# EasyEDA Pro project ProPrj_gd32f103c8t6扩展板_2026-03-23.epro

# Schematic Schematic1
Board Name: Board1; Create Date: 2026-03-16; Page Name: P1; Project Name: gd32f103c8t6扩展板; Schematic Name: Schematic1; Update Date: 2026-03-16; Company: 嘉立创EDA; Page Size: A4; Version: V1.0
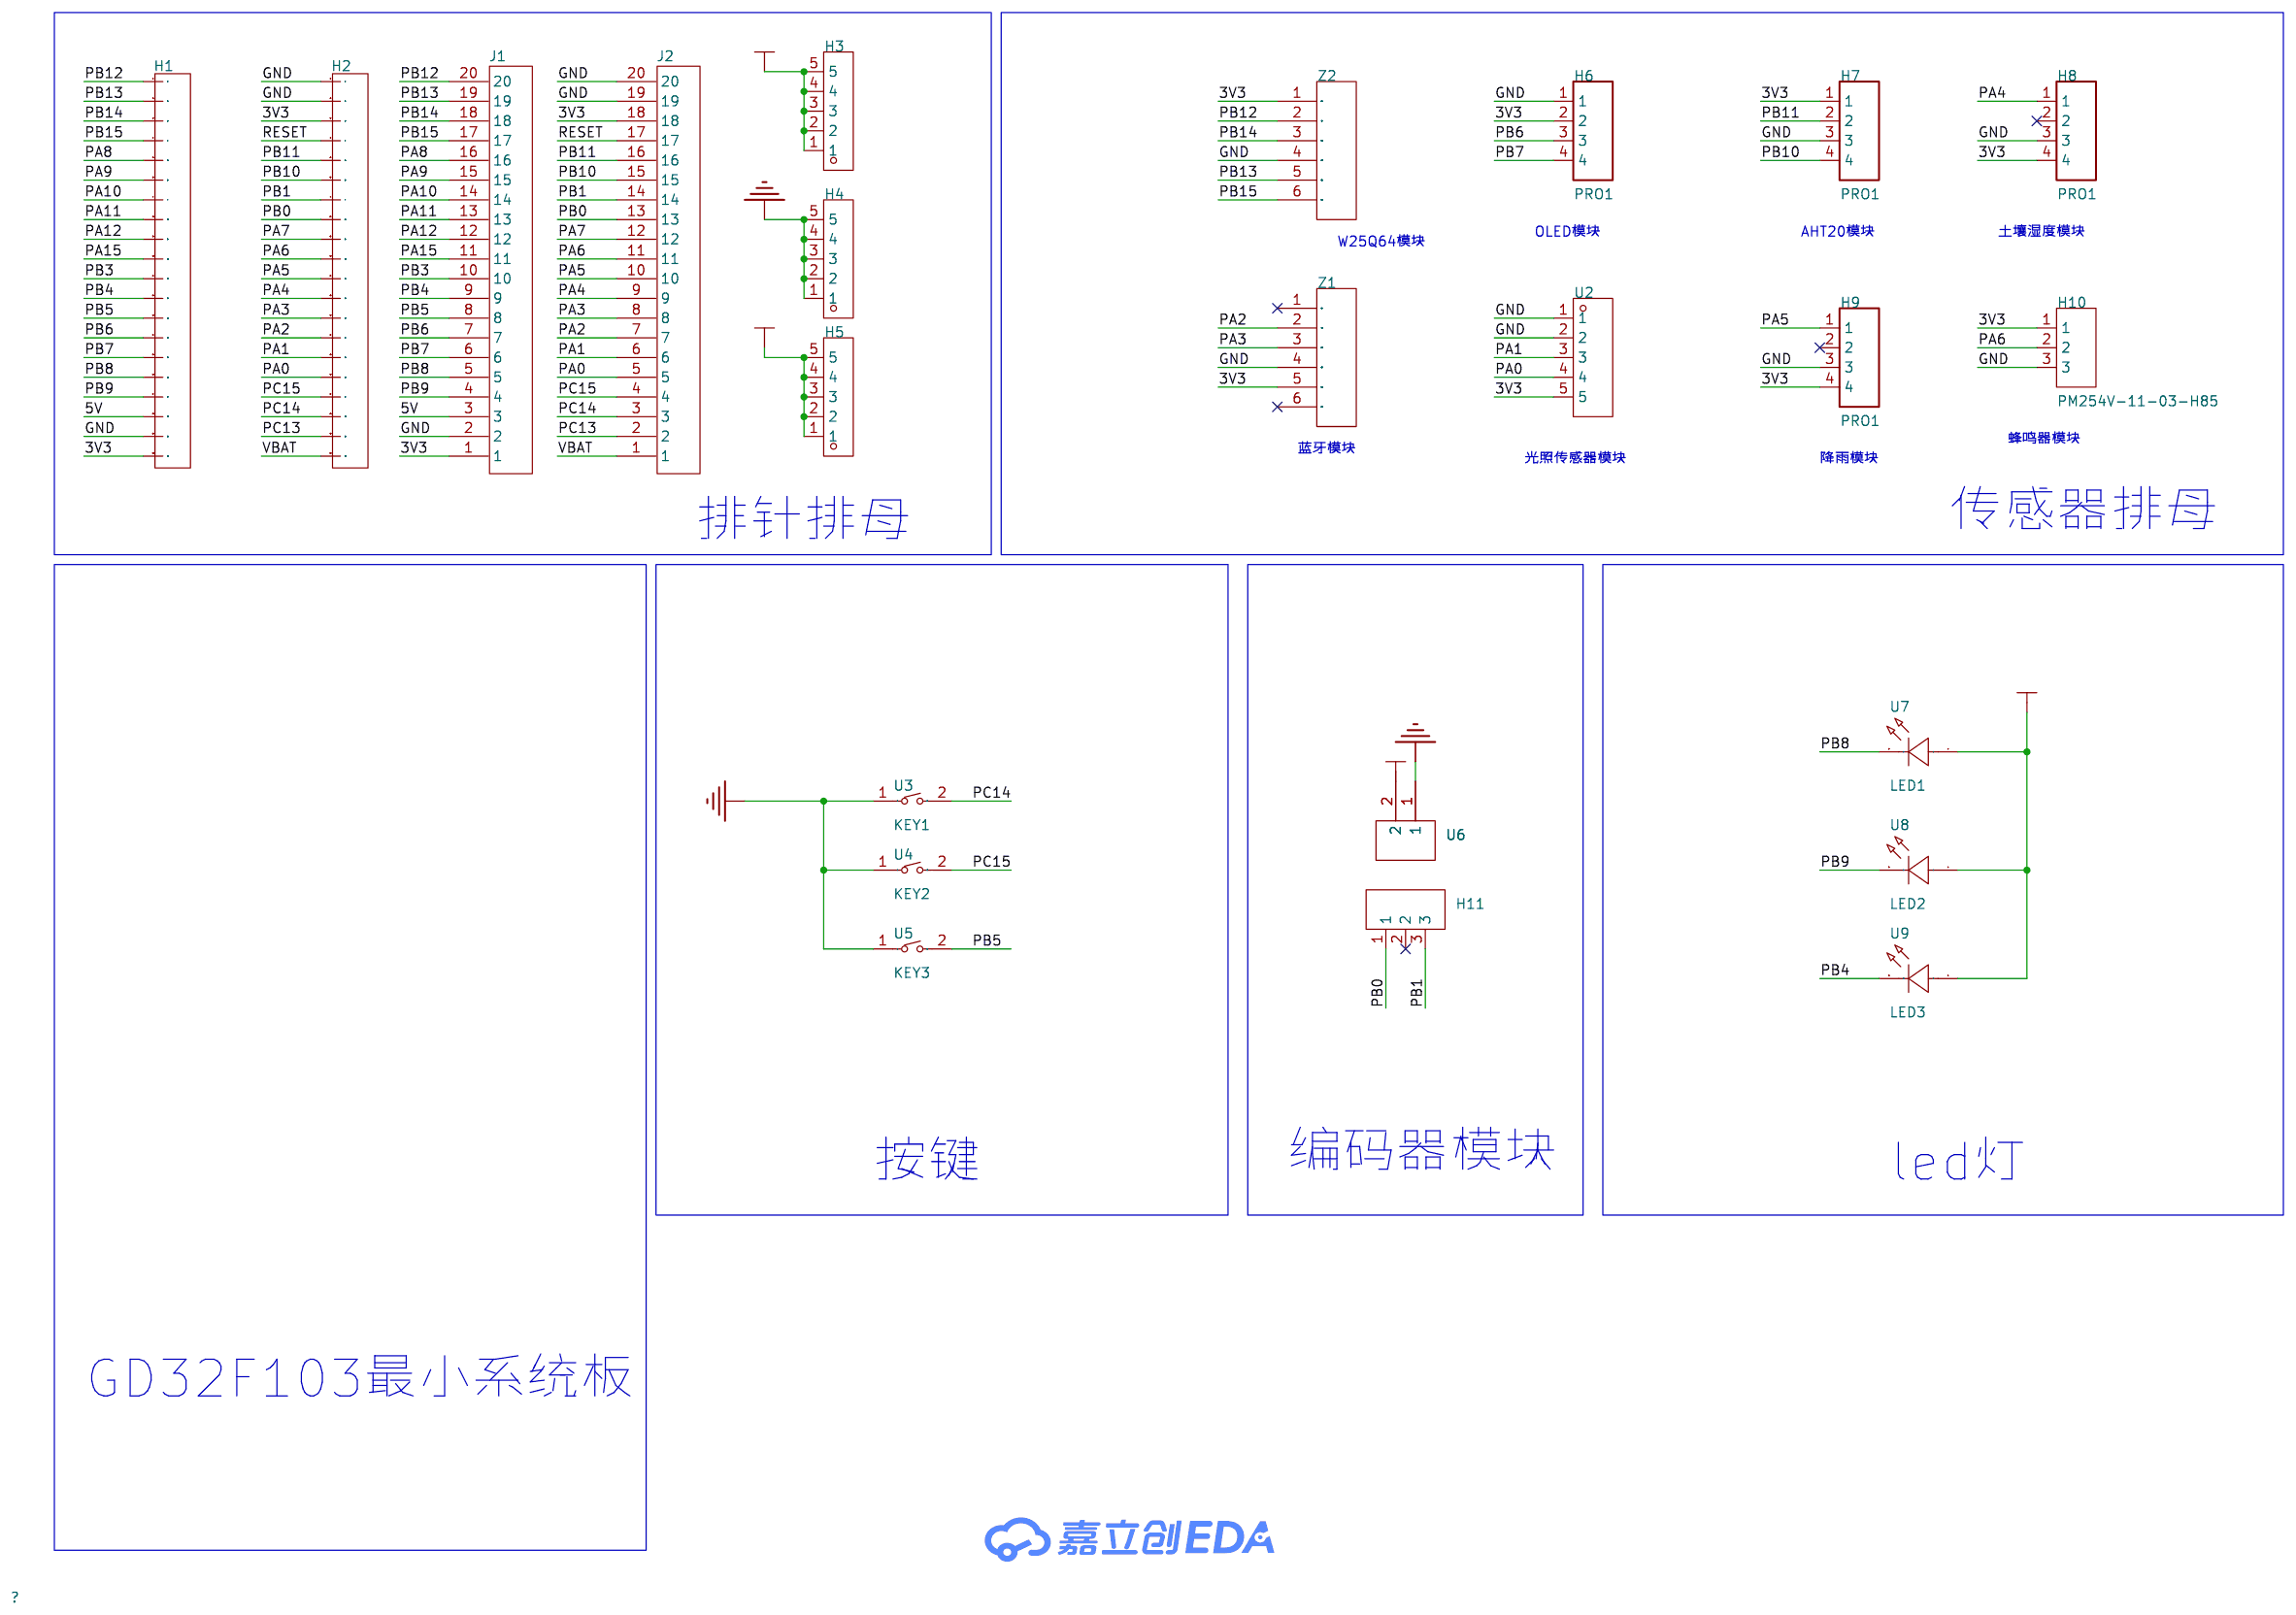
[diagram p0: schematic sheet]

## Parts
H1  -  [排针20P]
H2  -  [排针20P]
H3  -  [5P排针]
H4  -  [5P排针]
H5  -  [5P排针]
H6  PRO1  [HDR-TH_4P-P2.54-V-F]
H7  PRO1  [HDR-TH_4P-P2.54-V-F]
H8  PRO1  [HDR-TH_4P-P2.54-V-F]
H9  PRO1  [HDR-TH_4P-P2.54-V-F]
H10  PM254V-11-03-H85  [HDR-TH_3P-P2.54-V-F]
H11  PM254V-11-03-H85  [HDR-TH_3P-P2.54-V-F]
J1  -  [20P排针]
J2  -  [20P排针]
U2  -  [HDR-TH_5P-P2.54-V-F]
U3  KEY1  [KEY-SMD_L6.0-W3.5-LS8.0]
U4  KEY2  [KEY-SMD_L6.0-W3.5-LS8.0]
U5  KEY3  [KEY-SMD_L6.0-W3.5-LS8.0]
U6  -  [2P排母封装]
U7  LED1  [LED-TH_BD3.0-P2.54-FD]
U8  LED2  [LED-TH_BD3.0-P2.54-FD]
U9  LED3  [LED-TH_BD3.0-P2.54-FD]
Z1  -  [6P-2.54mm]
Z2  -  [6P-2.54mm]

## Library data of the parts
H1 H2 = 排母20P
H3-H5 = 5P排针: Supplier: LCSC; Supplier Part: C168673; Manufacturer: Amphenol ICC; Manufacturer Part: 68000-102HLF; _: 3
H6-H9 = 4P排母
H10 H11 = 排母3P: 插孔结构:1x3P;间距:2.54mm;行距:-;圆孔/方孔:方孔;安装方式:直插;排数:单排;总孔位数:3P;额定电流:3A;插孔方向:顶部;塑高:8.5mm;触头材质:黄铜;触头镀层:-;工作温度:-40℃~+105℃;; Manufacturer: XFCN(兴飞); Supplier: LCSC; Supplier Part: C541850; LCSC Part Name: 1x3P 间距:2.54mm 直插; Supplier Footprint: 插件,P=2.54mm; JLCPCB Part Class: Extended Part; Datasheet: https://item.szlcsc.com/datasheet/PM254V-11-03-H85/562471.html; Holes Structure: 1x3P; Pitch: 2.54mm; Circular Hole / Square Hole: 方孔; Mounting Type: 直插; Number of Rows: 单排; Number of Positions: 3P; Current Rating: 3A; Holes Direction: 顶部; Insulation Height: 8.5mm; Contact Material: 黄铜; Operating Temperature: -40℃~+105℃
J1 J2 = 20P排针
U2 = 单排母5P-2.54mm
U3-U5 = ZX-QC36-4.3TPWD: 电路结构:单刀单掷;按钮形状:矩形按钮;作用力:260gf;安装方式:立贴;开关长度:3mm;开关宽度:6mm;开关高度:4.3mm;带支架:不带;触点电流:50mA;额定电压(AC):250V;额定电压(DC):12V;绝缘电阻:100MΩ;机械寿命:10万次;; LCSC Part Name: 3*6*4.3贴片开关无定位; Supplier Part: C7470221; Manufacturer: Megastar(兆星); Supplier Footprint: SMD; JLCPCB Part Class: 扩展库; Datasheet: https://atta.szlcsc.com/upload/public/pdf/source/20230724/9B602E3A6629F513690F56C9FD4C5817.pdf; Supplier: LCSC; Circuit: 单刀单掷; Actuator Style: 矩形按钮; Operating Force: 260gf; Mounting Style: 立贴; Switch Length: 3mm; Switch Width: 6mm; Switch Height: 4.3mm; Strike Gundam: 不带; Contact Current: 50mA; Voltage Rating (AC): 250V; Voltage Rating (DC): 12V; Insulation Resistance: 100MΩ; Actuator/Cap Color: 白色; Pin Style: 鸥翼型; Mechanical Life: 10万次; Operating Temperature: -30℃~+80℃
U6 = 2P排母
U7-U9 = 3mmLED: Supplier: LCSC; Supplier Part: C9900095018; LCSC Part Name: 3mmFIR; Supplier Footprint: LED-TH_LED-3MM_RED; JLCPCB Part Class: 扩展库
Z1 Z2 = 排母6P

## Nets
3V3: H1.20 H2.3 H3.1 H3.2 H3.3 H3.4 H3.5 H6.2 H7.1 H8.4 H9.4 H10.1 J1.1 J2.18 U2.5 U6.2 U7.1(A) U8.1(A) U9.1(A) Z1.5(GP03) Z2.1(GND)
5V: H1.18 H5.1 H5.2 H5.3 H5.4 H5.5 J1.3
GND: H1.19 H2.1 H2.2 H4.1 H4.2 H4.3 H4.4 H4.5 H6.1 H7.3 H8.3 H9.3 H10.3 J1.2 J2.19 J2.20 U2.1 U2.2 U3.1 U4.1 U5.1 U6.1 Z1.4(GP02) Z2.4(GP02)
VBAT: H2.20 J2.1
PA0: H2.16 J2.5 U2.4
PA1: H2.15 J2.6 U2.3
PA2: H2.14 J2.7 Z1.2(VCC)
PA3: H2.13 J2.8 Z1.3(GP10)
PA4: H2.12 H8.1 J2.9
PA5: H2.11 H9.1 J2.10
PA6: H2.10 H10.2 J2.11
PA7: H2.9 J2.12
PA8: H1.5 J1.16
PA9: H1.6 J1.15
PA10: H1.7 J1.14
PA11: H1.8 J1.13
PA12: H1.9 J1.12
PA15: H1.10 J1.11
PB0: H2.8 H11.1 J2.13
PB1: H2.7 H11.3 J2.14
PB3: H1.11 J1.10
PB4: H1.12 J1.9 U9.2(K)
PB5: H1.13 J1.8 U5.2
PB6: H1.14 H6.3 J1.7
PB7: H1.15 H6.4 J1.6
PB8: H1.16 J1.5 U7.2(K)
PB9: H1.17 J1.4 U8.2(K)
PB10: H2.6 H7.4 J2.15
PB11: H2.5 H7.2 J2.16
PB12: H1.1 J1.20 Z2.2(VCC)
PB13: H1.2 J1.19 Z2.5(GP03)
PB14: H1.3 J1.18 Z2.3(GP10)
PB15: H1.4 J1.17 Z2.6(GND)
PC13: H2.19 J2.2
PC14: H2.18 J2.3 U3.2
PC15: H2.17 J2.4 U4.2
RESET: H2.4 J2.17

Not connected (* = marked no-connect by the designer): H8 2*; H9 2*; H11 2*; Z1 1(GND)* 6(GND)*

## Notes on the sheet
- W25Q64模块
- OLED模块
- AHT20模块
- 土壤湿度模块
- 蓝牙模块
- 光照传感器模块
- 降雨模块
- 蜂鸣器模块
- 传感器排母
- 排针排母
- 按键
- 编码器模块
- led灯
- GD32F103最小系统板

# Board PCB1
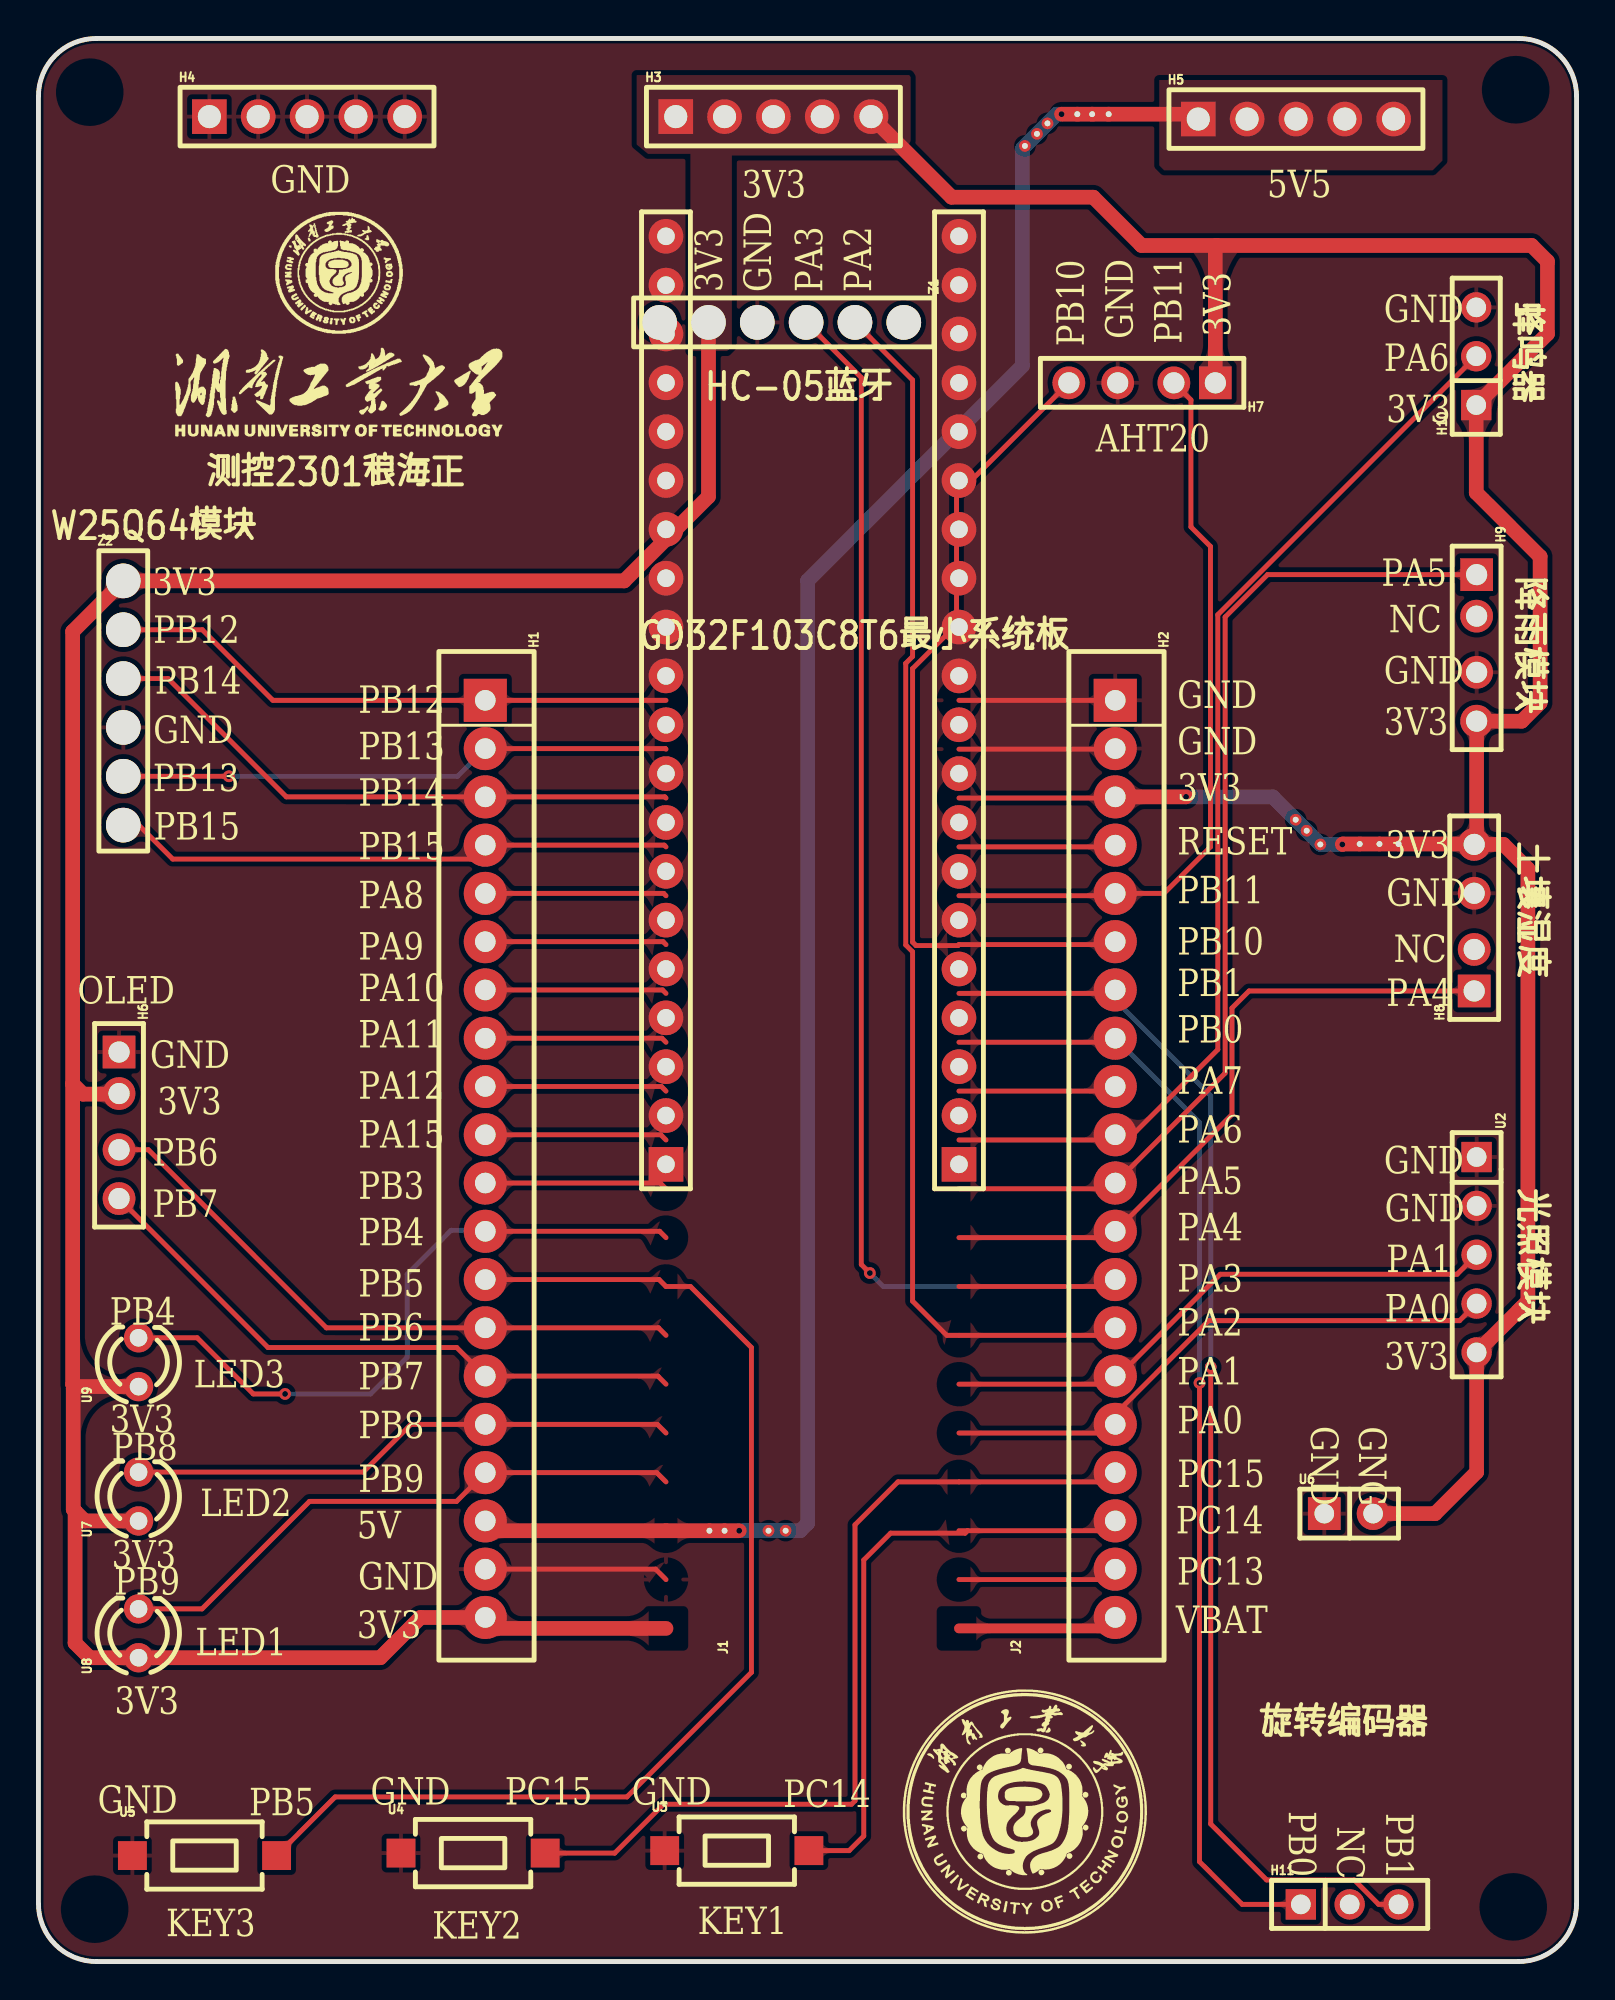
[diagram p1: board, top side]
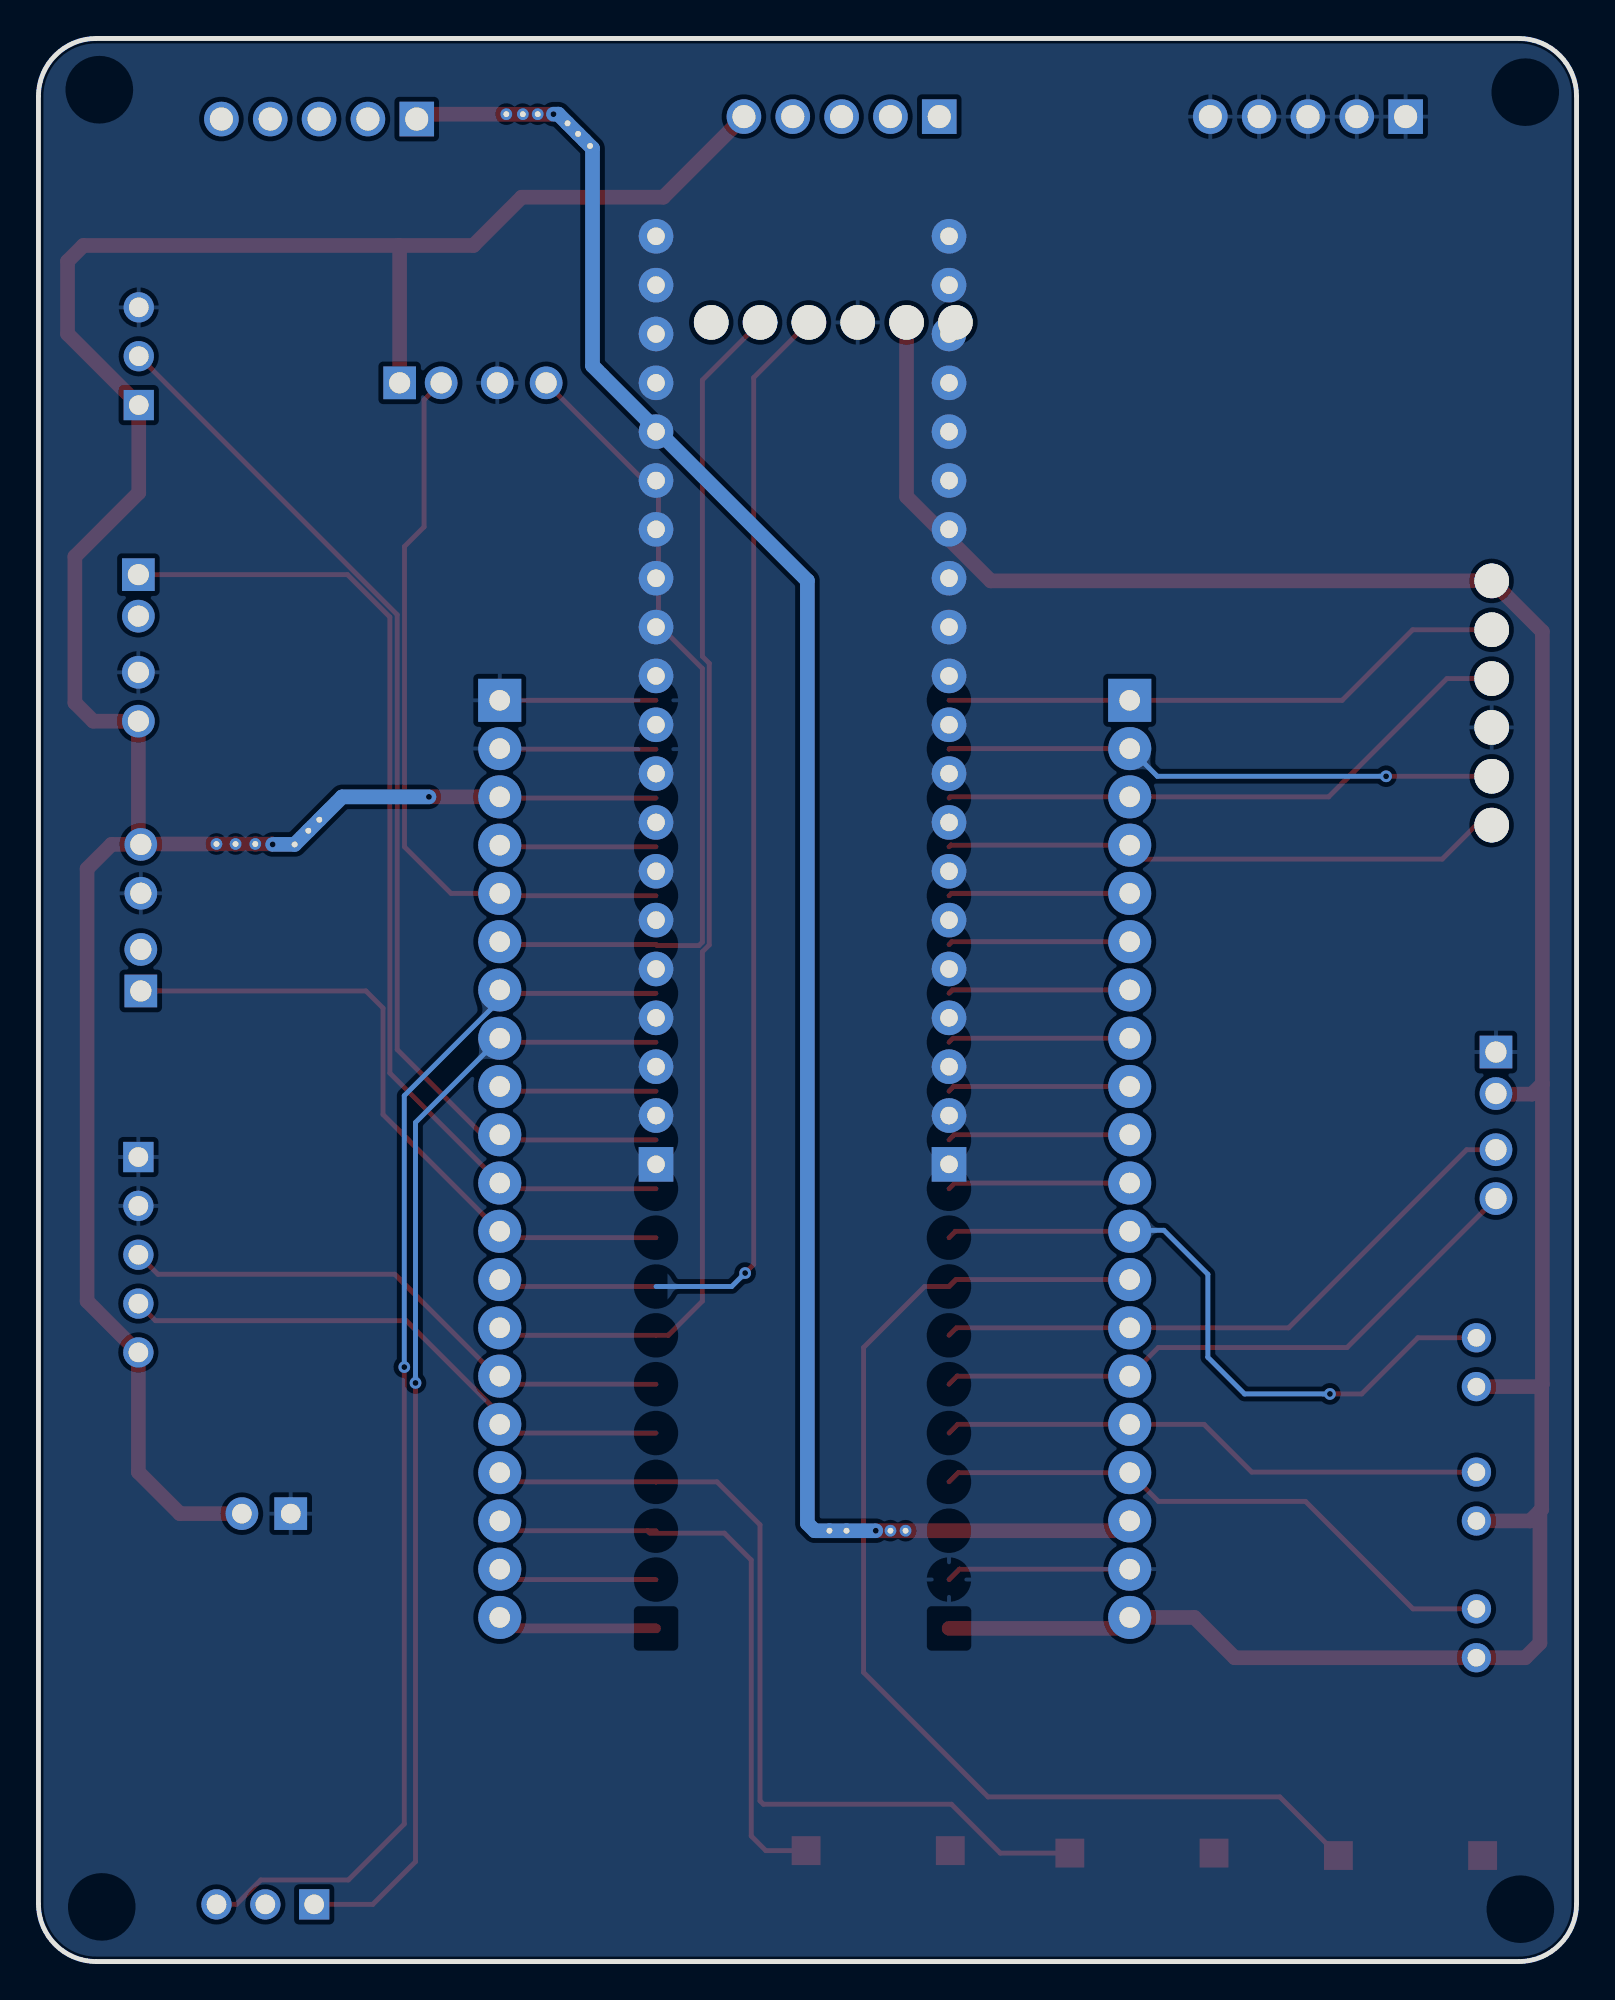
[diagram p2: board, bottom side, seen from below]

Outline 80 x 100 mm; copper layers: Top Layer, Bottom Layer. Coordinates in mm from the lower left corner of the outline.
Outline path: 0,97 0,3 arc(0.88,0.88) 3,0 77,0 arc(79.12,0.88) 80,3 80,97 arc(79.12,99.12) 77,100 3,100 arc(0.88,99.12) 0,97
Stack: Top Layer 0.035mm / Dielectric1 1.51mm FR4 er 4.5 / Bottom Layer 0.035mm

## Design rules (mm)
template: JLCPCB Capability(Two Layers Board)
spacing copperThickness1oz (default): track to track 0.102, other pairs 0.152 to 0.3
spacing copperThickness2oz: track to track 0.203, other pairs 0.152 to 0.3
track width copperThickness1oz (default): min 0.127, default 0.254, max 2.54
track width copperThickness2oz: min 0.203, default 0.254, max 2.54
differential pair differentialPair (default): width min 0.127, default 0.254, max 2.54; gap min 0.152, default 0.152
via viaSize (default): diameter min 0.5, default 0.61, max 10; hole min 0.3, default 0.305, max 6.3

## Placement (name value [footprint] x y rotation side)
H1  -  [排针20P]  23.24 65.58 270 top
H2  -  [排针20P]  56.01 65.58 270 top
H3  -  [5P排针]  34.42 95.94 0 top
H4  -  [5P排针]  10.16 95.94 0 top
H5  -  [5P排针]  61.59 95.81 0 top
H6  PRO1  [HDR-TH_4P-P2.54-V-F]  4.19 43.48 270 top
H7  PRO1  [HDR-TH_4P-P2.54-V-F]  57.4 82.09 180 top
H8  PRO1  [HDR-TH_4P-P2.54-V-F]  74.68 54.28 90 top
H9  PRO1  [HDR-TH_4P-P2.54-V-F]  74.8 68.31 270 top
H10  PM254V-11-03-H85  [HDR-TH_3P-P2.54-V-F]  74.78 83.48 90 top
H11  PM254V-11-03-H85  [HDR-TH_3P-P2.54-V-F]  68.2 2.97 0 top
J1  -  [20P排针]  32.64 41.45 90 top
J2  -  [20P排针]  47.88 41.45 90 top
NOREF  -  [Pad_e1266]  51.31 94.41 0 top
NOREF#2  -  [Pad_e1251]  55.66 96.06 0 top
NOREF#3  -  [Pad_e1263]  51.94 95.04 0 top
NOREF#4  -  [Pad_e1226]  38.86 22.4 0 top
NOREF#5  -  [Pad_e1288]  66.68 58.09 0 top
NOREF#6  -  [Pad_e1239]  54.03 96.06 0 top
NOREF#7  -  [Pad_e1276]  69.75 58.11 0 top
NOREF#8  -  [Pad_e1214]  34.9 22.4 0 top
NOREF#9  -  [Pad_e1204]  35.69 22.4 0 top
NOREF#10  -  [Pad_e1295]  65.39 59.37 0 top
NOREF#11  -  [Pad_e1289]  65.96 58.8 0 top
NOREF#12  -  [Pad_e1245]  54.81 96.06 0 top
NOREF#13  -  [Pad_e1282]  70.74 58.11 0 top
NOREF#14  -  [Pad_e1270]  68.72 58.11 0 top
NOREF#15  -  [Pad_e1220]  37.97 22.4 0 top
NOREF#16  -  [Pad_e1257]  52.48 95.59 0 top
U2  -  [HDR-TH_5P-P2.54-V-F]  74.8 36.75 270 top
U3  KEY1  [KEY-SMD_L6.0-W3.5-LS8.0]  36.32 5.77 0 top
U4  KEY2  [KEY-SMD_L6.0-W3.5-LS8.0]  22.61 5.64 0 top
U5  KEY3  [KEY-SMD_L6.0-W3.5-LS8.0]  8.64 5.51 0 top
U6  -  [2P排母封装]  68.2 23.29 0 top
U7  LED1  [LED-TH_BD3.0-P2.54-FD]  5.21 24.18 90 top
U8  LED2  [LED-TH_BD3.0-P2.54-FD]  5.21 17.07 90 top
U9  LED3  [LED-TH_BD3.0-P2.54-FD]  5.21 31.17 90 top
Z1  -  [6P-2.54mm]  38.61 85.27 270 top
Z2  -  [6P-2.54mm]  4.38 65.39 0 top

## Footprints (pads in the part's own frame, mm; a bottom-side part is the same pattern mirrored in y, then rotated)
2P排母封装
  rect 1.7x1.7 hole 1.02: 1(-1.321,0)
  round 1.7 hole 1.02: 2(1.22,0)
5P排针
  rect 1.8x1.8 hole 1.2: 1(-1.27,0)
  round 1.8 hole 1.2: 2(1.27,0) 3(3.81,0) 4(6.35,0) 5(8.89,0)
6P-2.54mm
  round 1.8 hole 1.2x1.8: 1(0.033,6.4) 2(0.033,3.86) 3(0.033,1.32) 4(0.033,-1.22) 5(0.033,-3.76) 6(0.033,-6.3)
20P排针
  rect 1.8x1.8 hole 0.914: 1(0,0)
  round 1.8 hole 0.914: 2(2.54,0) 3(5.08,0) 4(7.62,0) 5(10.16,0) 6(12.7,0) 7(15.24,0) 8(17.78,0) 9(20.32,0) 10(22.86,0) 11(25.4,0) 12(27.94,0) 13(30.48,0) 14(33.02,0) 15(35.56,0) 16(38.1,0) 17(40.64,0) 18(43.18,0) 19(45.72,0) 20(48.26,0)
HDR-TH_3P-P2.54-V-F
  rect 1.575x1.575 hole 1.02: 1(-2.54,0)
  round 1.575 hole 1.02: 2(0,0) 3(2.54,0)
HDR-TH_4P-P2.54-V-F
  rect 1.7x1.7 hole 1.1: 1(-3.81,0)
  round 1.7 hole 1.1: 2(-1.651,0) 3(1.27,0) 4(3.81,0)
HDR-TH_5P-P2.54-V-F
  rect 1.575x1.575 hole 1.02: 1(-5.08,0)
  round 1.575 hole 1.02: 2(-2.54,0) 3(0,0) 4(2.54,0) 5(5.08,0)
KEY-SMD_L6.0-W3.5-LS8.0
  rect 1.5x1.5 smd: 1(-3.75,0) 2(3.75,0)
LED-TH_BD3.0-P2.54-FD
  round 1.524 hole 0.914: 1(-1.27,0) 2(1.27,0)
Pad_e1204
  round 0.61 hole 0.305: 1(0,0)
Pad_e1214
  round 0.61 hole 0.305: 1(0,0)
Pad_e1220
  round 0.61 hole 0.305: 2(0,0)
Pad_e1226
  round 0.61 hole 0.305: 3(0,0)
Pad_e1239
  round 0.61 hole 0.305: 1(0,0)
Pad_e1245
  round 0.61 hole 0.305: 2(0,0)
Pad_e1251
  round 0.61 hole 0.305: 3(0,0)
Pad_e1257
  round 0.61 hole 0.305: 4(0,0)
Pad_e1263
  round 0.61 hole 0.305: 5(0,0)
Pad_e1266
  round 0.61 hole 0.305: 6(0,0)
Pad_e1270
  round 0.61 hole 0.305: 1(0,0)
Pad_e1276
  round 0.61 hole 0.305: 2(0,0)
Pad_e1282
  round 0.61 hole 0.305: 3(0,0)
Pad_e1288
  round 0.61 hole 0.305: 4(0,0)
Pad_e1289
  round 0.61 hole 0.305: 5(0,0)
Pad_e1295
  round 0.61 hole 0.305: 6(0,0)
排针20P
  rect 2.24x2.24 hole 1.07: 1(0,0)
  round 2.24 hole 1.07: 2(2.51,0) 3(5.02,0) 4(7.53,0) 5(10.04,0) 6(12.55,0) 7(15.06,0) 8(17.57,0) 9(20.08,0) 10(22.59,0) 11(25.1,0) 12(27.61,0) 13(30.12,0) 14(32.63,0) 15(35.14,0) 16(37.65,0) 17(40.16,0) 18(42.67,0) 19(45.18,0) 20(47.69,0)

## Nets
As in the schematic, except:
3V3: H1.20 H2.3 H3.1 H3.2 H3.3 H3.4 H3.5 H6.2 H7.1 H8.4 H9.4 H10.1 J1.1 J2.18 NOREF#5.4 NOREF#7.2 NOREF#10.6 NOREF#11.5 NOREF#13.3 NOREF#14.1 U2.5 U6.2 U7.1 U8.1 U9.1 Z1.5 Z2.1
5V: H1.18 H5.1 H5.2 H5.3 H5.4 H5.5 J1.3 NOREF.6 NOREF#2.3 NOREF#3.5 NOREF#4.3 NOREF#6.1 NOREF#8.1 NOREF#9.1 NOREF#12.2 NOREF#15.2 NOREF#16.4

Pads without a net: H8 2; H9 2; H11 2; Z1 1 6

## Via types
v1: diameter 0.61, hole 0.305, Top Layer to Bottom Layer, 9 vias

## Routing (per net, layer and track width the routed paths; a pad name or vN(x,y) marks a point on that pad's centre or on a via; arc(x,y) is an arc through that point)
3V3: length 290.8
  Top Layer w0.254: H2.3 55.95,60.5 47.88,60.5
  Top Layer w0.762: H8.4 74.8,58.22 H9.4 77.15,64.5 78.1,65.46 78.1,73.06 74.78,76.38 H10.1 78.49,84.64 78.49,88.41 77.66,89.24 61.26,89.24 ; H8.4 74.65,58.11 NOREF#13.3 NOREF#7.2 NOREF#14.1 67.84,58.11 v1(67.82,58.09) ; H8.4 76.2,58.09 77.47,56.82 77.47,34.34 U2.5 74.8,25.45 72.64,23.29 U6.2 ; H2.3 v1(59.69,60.56) ; H3.5 47.5,91.75 54.86,91.75 57.37,89.24 61.26,89.24 ; 61.26,89.24 61.21,89.19 H7.1 ; Z1.5 34.85,76.17 30.47,71.79 Z2.1 1.78,69.16 1.78,45.64 ; 1.91,23.42 1.91,16.56 2.67,15.8 17.78,15.8 19.87,17.89 H1.20 23.81,17.32 32.64,17.32 ; 1.91,23.42 1.81,23.51 1.81,29.8 1.91,29.9 ; 1.91,23.42 2.41,22.91 U7.1 ; U9.1 1.91,29.9 ; 1.91,29.9 1.78,30.02 1.78,45.64 ; 1.78,45.64 2.32,45.11 4.16,45.11 H6.2
  Bottom Layer w0.762: v1(67.82,58.09) NOREF#5.4 NOREF#11.5 NOREF#10.6 64.2,60.56 v1(59.69,60.56)
5V: length 103.2
  Top Layer w0.762: v1(36.45,22.4) NOREF#9.1 NOREF#8.1 23.75,22.4 H1.18 ; v1(53.21,96.06) NOREF#6.1 NOREF#12.2 NOREF#2.3 60.07,96.06 H5.1
  Bottom Layer w0.762: v1(53.21,96.06) 52.96,96.06 NOREF#16.4 NOREF#3.5 51.18,94.28 51.18,82.98 40,71.81 40,22.78 39.62,22.4 NOREF#4.3 NOREF#15.2 v1(36.45,22.4)
GND: length 25.9
  Top Layer w0.254: H2.2 55.98,63.04 47.88,63.04 ; H1.19 32.1,20.4 32.64,19.86 ; 47.88,65.58 H2.1
VBAT: length 8.4
  Top Layer w0.508: 47.88,17.32 55.44,17.32 H2.20
PA0: length 30
  Top Layer w0.254: U2.4 73.91,33.33 60.87,33.33 56.01,28.46 H2.16 55.56,27.48 47.88,27.48
PA1: length 29.7
  Top Layer w0.254: 47.88,30.02 55.59,30.02 56.01,30.44 56.17,30.44 61.47,35.74 73.79,35.74 U2.3
PA2: length 63.9
  Top Layer w0.254: H2.14 55.62,32.56 47.24,32.56 45.47,34.34 45.47,52.51 45.11,52.86 45.11,67.51 45.47,67.86 45.47,82.24 Z1.2
PA3: length 64
  Top Layer w0.254: Z1.3 42.8,82.36 42.8,36.25 v1(43.24,35.8) ; H2.13 55.65,35.1 47.88,35.1
  Bottom Layer w0.254: v1(43.24,35.8) 43.94,35.1 47.88,35.1
PA4: length 35.4
  Top Layer w0.254: H8.1 62.97,50.47 62.08,49.58 62.08,44.04 H2.12 55.68,37.64 47.88,37.64
PA5: length 54
  Top Layer w0.254: 47.88,40.18 55.71,40.18 H2.11 61.72,46.2 61.72,69.91 63.93,72.12 H9.1
PA6: length 57
  Top Layer w0.254: 47.88,42.72 55.74,42.72 H2.10 56.91,42.99 61.34,47.42 61.34,70.03 H10.2
PA7: length 8.2
  Top Layer w0.254: H2.9 55.77,45.26 47.88,45.26
PA8: length 9.4
  Top Layer w0.254: H1.5 32.52,55.54 32.64,55.42
PA9: length 9.5
  Top Layer w0.254: H1.6 32.49,53.03 32.64,52.88
PA10: length 9.5
  Top Layer w0.254: 32.64,50.34 32.46,50.52 H1.7
PA11: length 9.5
  Top Layer w0.254: H1.8 32.43,48.01 32.64,47.8
PA12: length 9.5
  Top Layer w0.254: H1.9 32.4,45.5 32.64,45.26
PA15: length 9.5
  Top Layer w0.254: 32.64,42.72 32.37,42.99 H1.10
PB0: length 59
  Top Layer w0.254: 47.88,47.8 55.8,47.8 H2.8 ; v1(60.39,30.09) 60.39,5.19 62.61,2.97 H11.1
  Bottom Layer w0.254: H2.8 60.39,43.63 v1(60.39,30.09)
PB1: length 65.1
  Top Layer w0.254: v1(60.97,30.91) 60.97,7.15 63.88,4.24 68.44,4.24 69.71,2.97 H11.3 ; 47.88,50.34 55.83,50.34 H2.7
  Bottom Layer w0.254: v1(60.97,30.91) 60.97,45.03 56.01,49.99 H2.7
PB3: length 9.5
  Top Layer w0.254: H1.11 32.34,40.48 32.64,40.18
PB4: length 34.9
  Top Layer w0.254: H1.12 32.31,37.97 32.64,37.64 ; U9.2 8.25,32.44 11.18,29.51 v1(12.83,29.51)
  Bottom Layer w0.254: v1(12.83,29.51) 17.27,29.51 19.18,31.42 19.18,35.74 21.46,38.02 23.19,38.02 H1.12
PB5: length 60.8
  Top Layer w0.254: H1.13 32.28,35.46 32.64,35.1 33.91,35.1 37.08,31.93 37.08,15.04 30.61,8.56 15.43,8.56 U5.2
PB6: length 32.4
  Top Layer w0.254: H6.3 5.72,42.22 14.98,32.95 H1.14 32.25,32.95 32.64,32.56
PB7: length 32.4
  Top Layer w0.254: H6.4 11.94,31.93 21.76,31.93 23.24,30.44 32.22,30.44 32.64,30.02
PB8: length 28.6
  Top Layer w0.254: 32.64,27.48 32.19,27.93 H1.16 19.37,27.93 16.89,25.45 U7.2
PB9: length 30.6
  Top Layer w0.254: 32.64,24.94 32.16,25.42 H1.17 21.75,23.93 14.1,23.93 8.51,18.34 U8.2
PB10: length 43.1
  Top Layer w0.254: H7.4 47.75,76.25 47.75,69.52 45.47,67.23 45.47,53.01 45.65,52.83 47.83,52.83 47.88,52.88 55.86,52.88 H2.6
PB11: length 39.1
  Top Layer w0.254: H7.2 59.94,81.2 59.94,74.6 60.96,73.58 60.96,57.96 58.54,55.54 H2.5 55.89,55.42 47.88,55.42
PB12: length 29.7
  Top Layer w0.254: 32.64,65.58 H1.1 12.19,65.58 8.52,69.25 Z2.2
PB13: length 28.8
  Top Layer w0.254: 32.64,63.04 32.61,63.07 H1.2 ; Z2.5 v1(9.91,61.63)
  Bottom Layer w0.254: v1(9.91,61.63) 21.8,61.63 H1.2
PB14: length 30.8
  Top Layer w0.254: Z2.3 6.74,66.71 12.89,60.56 H1.3 32.58,60.56 32.64,60.5
PB15: length 29.3
  Top Layer w0.254: 32.64,57.96 32.55,58.05 H1.4 22.52,57.33 6.98,57.33 5.22,59.09 Z2.6
PC13: length 8.4
  Top Layer w0.254: 47.88,19.86 55.47,19.86 H2.19
PC14: length 31.9
  Top Layer w0.254: 48.32,22.4 48.2,22.28 44.32,22.28 42.93,20.88 42.93,6.53 42.16,5.77 U3.2 ; 48.32,22.4 55.5,22.4 H2.18 ; 48.32,22.4 47.88,22.4
PC15: length 46.3
  Top Layer w0.254: U4.2 29.97,5.64 32.51,8.18 42.29,8.18 42.47,8.36 42.47,22.71 44.7,24.94 55.53,24.94 H2.17
RESET: length 8.2
  Top Layer w0.254: 47.88,57.96 55.92,57.96 H2.4

## Copper pours and planes (outline as drawn; the poured copper is in the pictures)
3V3 on Top Layer: 31.12,98.09 45.37,98.09 45.37,83.74 31.12,83.74
5V on Top Layer: 58.29,97.84 73.03,97.84 73.03,93.14 58.29,93.14
GND on Top Layer: -9.65,106.6 90.55,106.6 90.55,-6.55 -9.65,-6.55
GND on Bottom Layer: -18.42,111.18 98.43,111.18 98.43,-13.03 -18.42,-13.03

Small or netless copper shapes (teardrops, artwork), in the pictures only: 151 on Top Layer, 10 on Bottom Layer

## Text on the board
Top Silkscreen Layer: 测控2301稂海正 | GND | HC-05蓝牙 | 3V3 | AHT20 | 5V5 | PA3 | PA2 | PB10 | PB11 | 蜂鸣器 | 降雨模块 | 土壤湿度 | 光照模块 | PB6 | PB7 | PB13 | PB12 | PB15 | PB14 | KEY3 | LED3 | LED1 | LED2 | 5V | PA8 | PA9 | PA10 | PA11 | PA12 | PA15 | PB3 | PB4 | PB5 | PB8 | PB9 | KEY2 | KEY1 | PC14 | VBAT | PC13 | RESET | PB1 | PB0 | PA7 | PA6 | PA5 | PA4 | PA1 | PA0 | PC15 | 旋转编码器 | NC | GNG | W25Q64模块 | OLED | GD32F103C8T6最小系统板
